# EAGLE design GeneratedKeyboard (EAGLE 9.3.1)
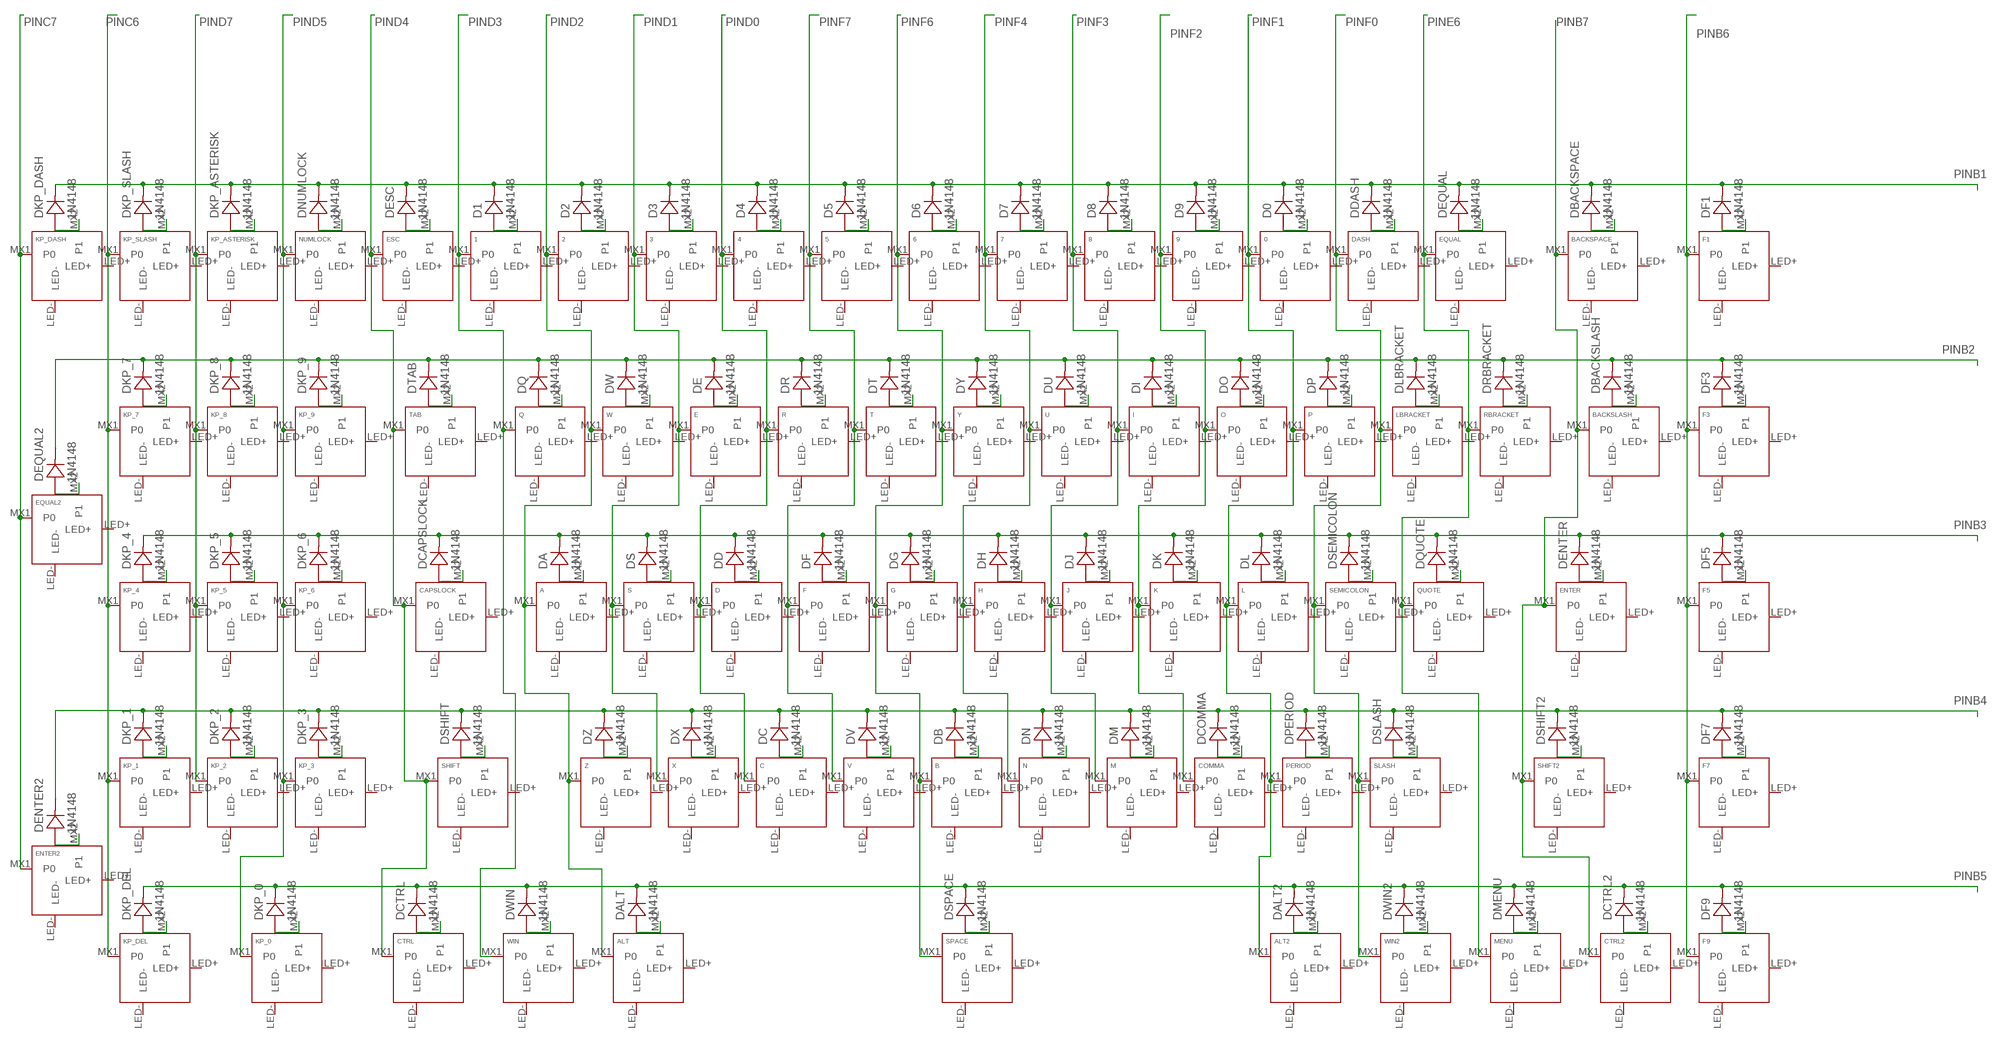
[diagram p0: schematic, sheet 1, part 1 of 2]
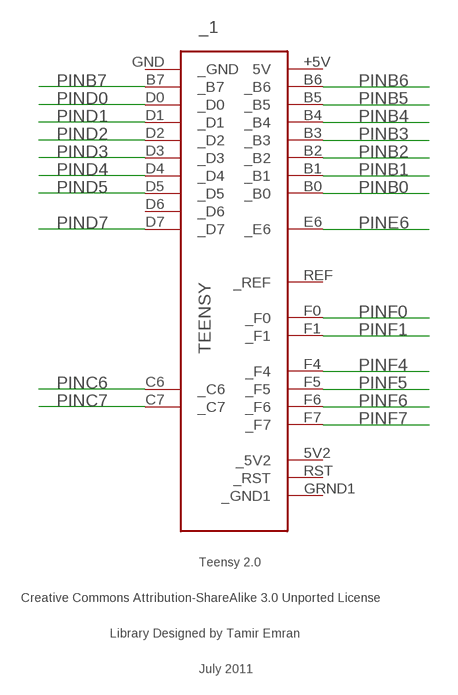
[diagram p1: schematic, sheet 1, part 2 of 2]

## Parts
0  KEYSWITCH-LED-MX-1U-LED  [MX-1U-LED]
1  KEYSWITCH-LED-MX-1U-LED  [MX-1U-LED]
2  KEYSWITCH-LED-MX-1U-LED  [MX-1U-LED]
3  KEYSWITCH-LED-MX-1U-LED  [MX-1U-LED]
4  KEYSWITCH-LED-MX-1U-LED  [MX-1U-LED]
5  KEYSWITCH-LED-MX-1U-LED  [MX-1U-LED]
6  KEYSWITCH-LED-MX-1U-LED  [MX-1U-LED]
7  KEYSWITCH-LED-MX-1U-LED  [MX-1U-LED]
8  KEYSWITCH-LED-MX-1U-LED  [MX-1U-LED]
9  KEYSWITCH-LED-MX-1U-LED  [MX-1U-LED]
_1  TEENSY  [TEENSY]
A  KEYSWITCH-LED-MX-1U-LED  [MX-1U-LED]
ALT  KEYSWITCH-LED-MX-1U-LED  [MX-1U-LED]
ALT2  KEYSWITCH-LED-MX-1U-LED  [MX-1U-LED]
B  KEYSWITCH-LED-MX-1U-LED  [MX-1U-LED]
BACKSLASH  KEYSWITCH-LED-MX-1U-LED  [MX-1U-LED]
BACKSPACE  KEYSWITCH-LED-MX-2U-LED  [MX-2U-LED]
C  KEYSWITCH-LED-MX-1U-LED  [MX-1U-LED]
CAPSLOCK  KEYSWITCH-LED-MX-1U-LED  [MX-1U-LED]
COMMA  KEYSWITCH-LED-MX-1U-LED  [MX-1U-LED]
CTRL  KEYSWITCH-LED-MX-1U-LED  [MX-1U-LED]
CTRL2  KEYSWITCH-LED-MX-1U-LED  [MX-1U-LED]
D  KEYSWITCH-LED-MX-1U-LED  [MX-1U-LED]
D0  1N4148  DIODE-DO-35  [DO-35]
D1  1N4148  DIODE-DO-35  [DO-35]
D2  1N4148  DIODE-DO-35  [DO-35]
D3  1N4148  DIODE-DO-35  [DO-35]
D4  1N4148  DIODE-DO-35  [DO-35]
D5  1N4148  DIODE-DO-35  [DO-35]
D6  1N4148  DIODE-DO-35  [DO-35]
D7  1N4148  DIODE-DO-35  [DO-35]
D8  1N4148  DIODE-DO-35  [DO-35]
D9  1N4148  DIODE-DO-35  [DO-35]
DA  1N4148  DIODE-DO-35  [DO-35]
DALT  1N4148  DIODE-DO-35  [DO-35]
DALT2  1N4148  DIODE-DO-35  [DO-35]
DASH  KEYSWITCH-LED-MX-1U-LED  [MX-1U-LED]
DB  1N4148  DIODE-DO-35  [DO-35]
DBACKSLASH  1N4148  DIODE-DO-35  [DO-35]
DBACKSPACE  1N4148  DIODE-DO-35  [DO-35]
DC  1N4148  DIODE-DO-35  [DO-35]
DCAPSLOCK  1N4148  DIODE-DO-35  [DO-35]
DCOMMA  1N4148  DIODE-DO-35  [DO-35]
DCTRL  1N4148  DIODE-DO-35  [DO-35]
DCTRL2  1N4148  DIODE-DO-35  [DO-35]
DD  1N4148  DIODE-DO-35  [DO-35]
DDASH  1N4148  DIODE-DO-35  [DO-35]
DE  1N4148  DIODE-DO-35  [DO-35]
DENTER  1N4148  DIODE-DO-35  [DO-35]
DENTER2  1N4148  DIODE-DO-35  [DO-35]
DEQUAL  1N4148  DIODE-DO-35  [DO-35]
DEQUAL2  1N4148  DIODE-DO-35  [DO-35]
DESC  1N4148  DIODE-DO-35  [DO-35]
DF  1N4148  DIODE-DO-35  [DO-35]
DF1  1N4148  DIODE-DO-35  [DO-35]
DF3  1N4148  DIODE-DO-35  [DO-35]
DF5  1N4148  DIODE-DO-35  [DO-35]
DF7  1N4148  DIODE-DO-35  [DO-35]
DF9  1N4148  DIODE-DO-35  [DO-35]
DG  1N4148  DIODE-DO-35  [DO-35]
DH  1N4148  DIODE-DO-35  [DO-35]
DI  1N4148  DIODE-DO-35  [DO-35]
DJ  1N4148  DIODE-DO-35  [DO-35]
DK  1N4148  DIODE-DO-35  [DO-35]
DKP_0  1N4148  DIODE-DO-35  [DO-35]
DKP_1  1N4148  DIODE-DO-35  [DO-35]
DKP_2  1N4148  DIODE-DO-35  [DO-35]
DKP_3  1N4148  DIODE-DO-35  [DO-35]
DKP_4  1N4148  DIODE-DO-35  [DO-35]
DKP_5  1N4148  DIODE-DO-35  [DO-35]
DKP_6  1N4148  DIODE-DO-35  [DO-35]
DKP_7  1N4148  DIODE-DO-35  [DO-35]
DKP_8  1N4148  DIODE-DO-35  [DO-35]
DKP_9  1N4148  DIODE-DO-35  [DO-35]
DKP_ASTERISK  1N4148  DIODE-DO-35  [DO-35]
DKP_DASH  1N4148  DIODE-DO-35  [DO-35]
DKP_DEL  1N4148  DIODE-DO-35  [DO-35]
DKP_SLASH  1N4148  DIODE-DO-35  [DO-35]
DL  1N4148  DIODE-DO-35  [DO-35]
DLBRACKET  1N4148  DIODE-DO-35  [DO-35]
DM  1N4148  DIODE-DO-35  [DO-35]
DMENU  1N4148  DIODE-DO-35  [DO-35]
DN  1N4148  DIODE-DO-35  [DO-35]
DNUMLOCK  1N4148  DIODE-DO-35  [DO-35]
DO  1N4148  DIODE-DO-35  [DO-35]
DP  1N4148  DIODE-DO-35  [DO-35]
DPERIOD  1N4148  DIODE-DO-35  [DO-35]
DQ  1N4148  DIODE-DO-35  [DO-35]
DQUOTE  1N4148  DIODE-DO-35  [DO-35]
DR  1N4148  DIODE-DO-35  [DO-35]
DRBRACKET  1N4148  DIODE-DO-35  [DO-35]
DS  1N4148  DIODE-DO-35  [DO-35]
DSEMICOLON  1N4148  DIODE-DO-35  [DO-35]
DSHIFT  1N4148  DIODE-DO-35  [DO-35]
DSHIFT2  1N4148  DIODE-DO-35  [DO-35]
DSLASH  1N4148  DIODE-DO-35  [DO-35]
DSPACE  1N4148  DIODE-DO-35  [DO-35]
DT  1N4148  DIODE-DO-35  [DO-35]
DTAB  1N4148  DIODE-DO-35  [DO-35]
DU  1N4148  DIODE-DO-35  [DO-35]
DV  1N4148  DIODE-DO-35  [DO-35]
DW  1N4148  DIODE-DO-35  [DO-35]
DWIN  1N4148  DIODE-DO-35  [DO-35]
DWIN2  1N4148  DIODE-DO-35  [DO-35]
DX  1N4148  DIODE-DO-35  [DO-35]
DY  1N4148  DIODE-DO-35  [DO-35]
DZ  1N4148  DIODE-DO-35  [DO-35]
E  KEYSWITCH-LED-MX-1U-LED  [MX-1U-LED]
ENTER  KEYSWITCH-LED-MX-2U-LED  [MX-2U-LED]
ENTER2  KEYSWITCH-LED-MX-1U-LED  [MX-1U-LED]
EQUAL  KEYSWITCH-LED-MX-1U-LED  [MX-1U-LED]
EQUAL2  KEYSWITCH-LED-MX-1U-LED  [MX-1U-LED]
ESC  KEYSWITCH-LED-MX-1U-LED  [MX-1U-LED]
F  KEYSWITCH-LED-MX-1U-LED  [MX-1U-LED]
F1  KEYSWITCH-LED-MX-1U-LED  [MX-1U-LED]
F3  KEYSWITCH-LED-MX-1U-LED  [MX-1U-LED]
F5  KEYSWITCH-LED-MX-1U-LED  [MX-1U-LED]
F7  KEYSWITCH-LED-MX-1U-LED  [MX-1U-LED]
F9  KEYSWITCH-LED-MX-1U-LED  [MX-1U-LED]
G  KEYSWITCH-LED-MX-1U-LED  [MX-1U-LED]
H  KEYSWITCH-LED-MX-1U-LED  [MX-1U-LED]
I  KEYSWITCH-LED-MX-1U-LED  [MX-1U-LED]
J  KEYSWITCH-LED-MX-1U-LED  [MX-1U-LED]
K  KEYSWITCH-LED-MX-1U-LED  [MX-1U-LED]
KP_0  KEYSWITCH-LED-MX-2U-LED  [MX-2U-LED]
KP_1  KEYSWITCH-LED-MX-1U-LED  [MX-1U-LED]
KP_2  KEYSWITCH-LED-MX-1U-LED  [MX-1U-LED]
KP_3  KEYSWITCH-LED-MX-1U-LED  [MX-1U-LED]
KP_4  KEYSWITCH-LED-MX-1U-LED  [MX-1U-LED]
KP_5  KEYSWITCH-LED-MX-1U-LED  [MX-1U-LED]
KP_6  KEYSWITCH-LED-MX-1U-LED  [MX-1U-LED]
KP_7  KEYSWITCH-LED-MX-1U-LED  [MX-1U-LED]
KP_8  KEYSWITCH-LED-MX-1U-LED  [MX-1U-LED]
KP_9  KEYSWITCH-LED-MX-1U-LED  [MX-1U-LED]
KP_ASTERISK  KEYSWITCH-LED-MX-1U-LED  [MX-1U-LED]
KP_DASH  KEYSWITCH-LED-MX-1U-LED  [MX-1U-LED]
KP_DEL  KEYSWITCH-LED-MX-1U-LED  [MX-1U-LED]
KP_SLASH  KEYSWITCH-LED-MX-1U-LED  [MX-1U-LED]
L  KEYSWITCH-LED-MX-1U-LED  [MX-1U-LED]
LBRACKET  KEYSWITCH-LED-MX-1U-LED  [MX-1U-LED]
M  KEYSWITCH-LED-MX-1U-LED  [MX-1U-LED]
MENU  KEYSWITCH-LED-MX-1U-LED  [MX-1U-LED]
N  KEYSWITCH-LED-MX-1U-LED  [MX-1U-LED]
NUMLOCK  KEYSWITCH-LED-MX-1U-LED  [MX-1U-LED]
O  KEYSWITCH-LED-MX-1U-LED  [MX-1U-LED]
P  KEYSWITCH-LED-MX-1U-LED  [MX-1U-LED]
PERIOD  KEYSWITCH-LED-MX-1U-LED  [MX-1U-LED]
Q  KEYSWITCH-LED-MX-1U-LED  [MX-1U-LED]
QUOTE  KEYSWITCH-LED-MX-1U-LED  [MX-1U-LED]
R  KEYSWITCH-LED-MX-1U-LED  [MX-1U-LED]
RBRACKET  KEYSWITCH-LED-MX-1U-LED  [MX-1U-LED]
S  KEYSWITCH-LED-MX-1U-LED  [MX-1U-LED]
SEMICOLON  KEYSWITCH-LED-MX-1U-LED  [MX-1U-LED]
SHIFT  KEYSWITCH-LED-MX-2U-LED  [MX-2U-LED]
SHIFT2  KEYSWITCH-LED-MX-2U-LED  [MX-2U-LED]
SLASH  KEYSWITCH-LED-MX-1U-LED  [MX-1U-LED]
SPACE  KEYSWITCH-LED-MX-6.25U-LED  [MX-6.25U-LED]
T  KEYSWITCH-LED-MX-1U-LED  [MX-1U-LED]
TAB  KEYSWITCH-LED-MX-1U-LED  [MX-1U-LED]
U  KEYSWITCH-LED-MX-1U-LED  [MX-1U-LED]
V  KEYSWITCH-LED-MX-1U-LED  [MX-1U-LED]
W  KEYSWITCH-LED-MX-1U-LED  [MX-1U-LED]
WIN  KEYSWITCH-LED-MX-1U-LED  [MX-1U-LED]
WIN2  KEYSWITCH-LED-MX-1U-LED  [MX-1U-LED]
X  KEYSWITCH-LED-MX-1U-LED  [MX-1U-LED]
Y  KEYSWITCH-LED-MX-1U-LED  [MX-1U-LED]
Z  KEYSWITCH-LED-MX-1U-LED  [MX-1U-LED]

## Nets
N$1: DKP_DASH.A KP_DASH.MX2(P1)
N$2: DKP_SLASH.A KP_SLASH.MX2(P1)
N$3: DKP_ASTERISK.A KP_ASTERISK.MX2(P1)
N$4: DNUMLOCK.A NUMLOCK.MX2(P1)
N$5: DESC.A ESC.MX2(P1)
N$6: 2.MX2(P1) D2.A
N$7: 3.MX2(P1) D3.A
N$8: 1.MX2(P1) D1.A
N$9: 4.MX2(P1) D4.A
N$10: 5.MX2(P1) D5.A
N$11: 6.MX2(P1) D6.A
N$12: 7.MX2(P1) D7.A
N$13: 8.MX2(P1) D8.A
N$14: 9.MX2(P1) D9.A
N$15: 0.MX2(P1) D0.A
N$16: DASH.MX2(P1) DDASH.A
N$17: DEQUAL.A EQUAL.MX2(P1)
N$18: BACKSPACE.MX2(P1) DBACKSPACE.A
N$19: DF1.A F1.MX2(P1)
N$20: DF3.A F3.MX2(P1)
N$21: BACKSLASH.MX2(P1) DBACKSLASH.A
N$22: DRBRACKET.A RBRACKET.MX2(P1)
N$23: DLBRACKET.A LBRACKET.MX2(P1)
N$24: DP.A P.MX2(P1)
N$25: DO.A O.MX2(P1)
N$26: DI.A I.MX2(P1)
N$27: DU.A U.MX2(P1)
N$28: DY.A Y.MX2(P1)
N$29: DT.A T.MX2(P1)
N$30: DR.A R.MX2(P1)
N$31: DE.A E.MX2(P1)
N$32: DW.A W.MX2(P1)
N$33: DQ.A Q.MX2(P1)
N$34: DTAB.A TAB.MX2(P1)
N$35: DKP_9.A KP_9.MX2(P1)
N$36: DKP_8.A KP_8.MX2(P1)
N$37: DKP_7.A KP_7.MX2(P1)
N$38: DEQUAL2.A EQUAL2.MX2(P1)
N$39: DKP_4.A KP_4.MX2(P1)
N$40: DKP_5.A KP_5.MX2(P1)
N$41: DKP_6.A KP_6.MX2(P1)
N$42: CAPSLOCK.MX2(P1) DCAPSLOCK.A
N$43: A.MX2(P1) DA.A
N$44: DS.A S.MX2(P1)
N$45: D.MX2(P1) DD.A
N$46: DF.A F.MX2(P1)
N$47: DG.A G.MX2(P1)
N$48: DH.A H.MX2(P1)
N$49: DJ.A J.MX2(P1)
N$50: DK.A K.MX2(P1)
N$51: DL.A L.MX2(P1)
N$52: DSEMICOLON.A SEMICOLON.MX2(P1)
N$53: DQUOTE.A QUOTE.MX2(P1)
N$54: DENTER.A ENTER.MX2(P1)
N$55: DF5.A F5.MX2(P1)
N$56: DF7.A F7.MX2(P1)
N$57: DSHIFT2.A SHIFT2.MX2(P1)
N$58: DSLASH.A SLASH.MX2(P1)
N$59: DPERIOD.A PERIOD.MX2(P1)
N$60: COMMA.MX2(P1) DCOMMA.A
N$61: DM.A M.MX2(P1)
N$62: DN.A N.MX2(P1)
N$63: B.MX2(P1) DB.A
N$64: DV.A V.MX2(P1)
N$65: C.MX2(P1) DC.A
N$66: DX.A X.MX2(P1)
N$67: DZ.A Z.MX2(P1)
N$68: DSHIFT.A SHIFT.MX2(P1)
N$69: DKP_3.A KP_3.MX2(P1)
N$70: DKP_2.A KP_2.MX2(P1)
N$71: DKP_1.A KP_1.MX2(P1)
N$72: DENTER2.A ENTER2.MX2(P1)
N$73: DKP_DEL.A KP_DEL.MX2(P1)
N$74: DKP_0.A KP_0.MX2(P1)
N$75: CTRL.MX2(P1) DCTRL.A
N$76: DWIN.A WIN.MX2(P1)
N$77: ALT.MX2(P1) DALT.A
N$78: DSPACE.A SPACE.MX2(P1)
N$79: ALT2.MX2(P1) DALT2.A
N$80: DWIN2.A WIN2.MX2(P1)
N$81: DMENU.A MENU.MX2(P1)
N$82: CTRL2.MX2(P1) DCTRL2.A
N$83: DF9.A F9.MX2(P1)
PINB0: _1.B0(_B0)
PINB1: _1.B1(_B1) D0.C D1.C D2.C D3.C D4.C D5.C D6.C D7.C D8.C D9.C DBACKSPACE.C DDASH.C DEQUAL.C DESC.C DF1.C DKP_ASTERISK.C DKP_DASH.C DKP_SLASH.C DNUMLOCK.C
PINB2: _1.B2(_B2) DBACKSLASH.C DE.C DEQUAL2.C DF3.C DI.C DKP_7.C DKP_8.C DKP_9.C DLBRACKET.C DO.C DP.C DQ.C DR.C DRBRACKET.C DT.C DTAB.C DU.C DW.C DY.C
PINB3: _1.B3(_B3) DA.C DCAPSLOCK.C DD.C DENTER.C DF5.C DF.C DG.C DH.C DJ.C DK.C DKP_4.C DKP_5.C DKP_6.C DL.C DQUOTE.C DS.C DSEMICOLON.C
PINB4: _1.B4(_B4) DB.C DC.C DCOMMA.C DENTER2.C DF7.C DKP_1.C DKP_2.C DKP_3.C DM.C DN.C DPERIOD.C DSHIFT2.C DSHIFT.C DSLASH.C DV.C DX.C DZ.C
PINB5: _1.B5(_B5) DALT2.C DALT.C DCTRL2.C DCTRL.C DF9.C DKP_0.C DKP_DEL.C DMENU.C DSPACE.C DWIN2.C DWIN.C
PINB6: _1.B6(_B6) F1.MX1(P0) F3.MX1(P0) F5.MX1(P0) F7.MX1(P0) F9.MX1(P0)
PINB7: _1.B7(_B7) BACKSLASH.MX1(P0) BACKSPACE.MX1(P0) CTRL2.MX1(P0) ENTER.MX1(P0) SHIFT2.MX1(P0)
PINC6: _1.C6(_C6) KP_1.MX1(P0) KP_4.MX1(P0) KP_7.MX1(P0) KP_DEL.MX1(P0) KP_SLASH.MX1(P0)
PINC7: _1.C7(_C7) ENTER2.MX1(P0) EQUAL2.MX1(P0) KP_DASH.MX1(P0)
PIND0: 4.MX1(P0) _1.D0(_D0) C.MX1(P0) D.MX1(P0) R.MX1(P0)
PIND1: 3.MX1(P0) _1.D1(_D1) E.MX1(P0) S.MX1(P0) X.MX1(P0)
PIND2: 2.MX1(P0) _1.D2(_D2) A.MX1(P0) ALT.MX1(P0) W.MX1(P0) Z.MX1(P0)
PIND3: 1.MX1(P0) _1.D3(_D3) Q.MX1(P0) WIN.MX1(P0)
PIND4: _1.D4(_D4) CAPSLOCK.MX1(P0) CTRL.MX1(P0) ESC.MX1(P0) SHIFT.MX1(P0) TAB.MX1(P0)
PIND5: _1.D5(_D5) KP_0.MX1(P0) KP_3.MX1(P0) KP_6.MX1(P0) KP_9.MX1(P0) NUMLOCK.MX1(P0)
PIND7: _1.D7(_D7) KP_2.MX1(P0) KP_5.MX1(P0) KP_8.MX1(P0) KP_ASTERISK.MX1(P0)
PINE6: _1.E6(_E6) EQUAL.MX1(P0) MENU.MX1(P0) QUOTE.MX1(P0) RBRACKET.MX1(P0)
PINF0: _1.F0(_F0) DASH.MX1(P0) LBRACKET.MX1(P0) SEMICOLON.MX1(P0) SLASH.MX1(P0) WIN2.MX1(P0)
PINF1: 0.MX1(P0) _1.F1(_F1) ALT2.MX1(P0) L.MX1(P0) P.MX1(P0) PERIOD.MX1(P0)
PINF2: 9.MX1(P0) COMMA.MX1(P0) K.MX1(P0) O.MX1(P0)
PINF3: 8.MX1(P0) I.MX1(P0) J.MX1(P0) M.MX1(P0)
PINF4: 7.MX1(P0) _1.F4(_F4) H.MX1(P0) N.MX1(P0) U.MX1(P0)
PINF5: _1.F5(_F5)
PINF6: 6.MX1(P0) _1.F6(_F6) B.MX1(P0) G.MX1(P0) SPACE.MX1(P0) Y.MX1(P0)
PINF7: 5.MX1(P0) _1.F7(_F7) F.MX1(P0) T.MX1(P0) V.MX1(P0)
Unconnected: 0.LED+ 0.LED- 1.LED+ 1.LED- 2.LED+ 2.LED- 3.LED+ 3.LED- 4.LED+ 4.LED- 5.LED+ 5.LED- 6.LED+ 6.LED- 7.LED+ 7.LED- 8.LED+ 8.LED- 9.LED+ 9.LED- _1.5V2(_5V2) _1.+5V(5V) _1.D6(_D6) _1.GND(_GND) _1.GRND1(_GND1) _1.REF(_REF) _1.RST(_RST) A.LED+ A.LED- ALT2.LED+ ALT2.LED- ALT.LED+ ALT.LED- B.LED+ B.LED- BACKSLASH.LED+ BACKSLASH.LED- BACKSPACE.LED+ BACKSPACE.LED- C.LED+ C.LED- CAPSLOCK.LED+ CAPSLOCK.LED- COMMA.LED+ COMMA.LED- CTRL2.LED+ CTRL2.LED- CTRL.LED+ CTRL.LED- D.LED+ D.LED- DASH.LED+ DASH.LED- E.LED+ E.LED- ENTER2.LED+ ENTER2.LED- ENTER.LED+ ENTER.LED- EQUAL2.LED+ EQUAL2.LED- EQUAL.LED+ EQUAL.LED- ESC.LED+ ESC.LED- F1.LED+ F1.LED- F3.LED+ F3.LED- F5.LED+ F5.LED- F7.LED+ F7.LED- F9.LED+ F9.LED- F.LED+ F.LED- G.LED+ G.LED- H.LED+ H.LED- I.LED+ I.LED- J.LED+ J.LED- K.LED+ K.LED- KP_0.LED+ KP_0.LED- KP_1.LED+ KP_1.LED- KP_2.LED+ KP_2.LED- KP_3.LED+ KP_3.LED- KP_4.LED+ KP_4.LED- KP_5.LED+ KP_5.LED- KP_6.LED+ KP_6.LED- KP_7.LED+ KP_7.LED- KP_8.LED+ KP_8.LED- KP_9.LED+ KP_9.LED- KP_ASTERISK.LED+ KP_ASTERISK.LED- KP_DASH.LED+ KP_DASH.LED- KP_DEL.LED+ KP_DEL.LED- KP_SLASH.LED+ KP_SLASH.LED- L.LED+ L.LED- LBRACKET.LED+ LBRACKET.LED- M.LED+ M.LED- MENU.LED+ MENU.LED- N.LED+ N.LED- NUMLOCK.LED+ NUMLOCK.LED- O.LED+ O.LED- P.LED+ P.LED- PERIOD.LED+ PERIOD.LED- Q.LED+ Q.LED- QUOTE.LED+ QUOTE.LED- R.LED+ R.LED- RBRACKET.LED+ RBRACKET.LED- S.LED+ S.LED- SEMICOLON.LED+ SEMICOLON.LED- SHIFT2.LED+ SHIFT2.LED- SHIFT.LED+ SHIFT.LED- SLASH.LED+ SLASH.LED- SPACE.LED+ SPACE.LED- T.LED+ T.LED- TAB.LED+ TAB.LED- U.LED+ U.LED- V.LED+ V.LED- W.LED+ W.LED- WIN2.LED+ WIN2.LED- WIN.LED+ WIN.LED- X.LED+ X.LED- Y.LED+ Y.LED- Z.LED+ Z.LED-

## Library data of the parts
0 1-9 A ALT ALT2 B BACKSLASH BACKSPACE C CAPSLOCK COMMA CTRL CTRL2 D DASH E ENTER ENTER2 EQUAL EQUAL2 ESC F F1 F3 F5 F7 F9 G H I J K KP_0 KP_1-KP_9 KP_ASTERISK KP_DASH KP_DEL KP_SLASH L LBRACKET M MENU N NUMLOCK O P PERIOD Q QUOTE R RBRACKET S SEMICOLON SHIFT SHIFT2 SLASH SPACE T TAB U V W WIN WIN2 X Y Z = Keyboard:KEYSWITCH-LED
_1 = teensy:TEENSY: Teensy 2.0 Original Design by Clint Fisher Modified Design by Tamir Emran Licensed Under Creative Commons Attribution-ShareAlike 3.0 Unported (CC BY-SA 3.0)
D0 D1-D9 DA DALT DALT2 DB DBACKSLASH DBACKSPACE DC DCAPSLOCK DCOMMA DCTRL DCTRL2 DD DDASH DE DENTER DENTER2 DEQUAL DEQUAL2 DESC DF DF1 DF3 DF5 DF7 DF9 DG DH DI DJ DK DKP_0 DKP_1-DKP_9 DKP_ASTERISK DKP_DASH DKP_DEL DKP_SLASH DL DLBRACKET DM DMENU DN DNUMLOCK DO DP DPERIOD DQ DQUOTE DR DRBRACKET DS DSEMICOLON DSHIFT DSHIFT2 DSLASH DSPACE DT DTAB DU DV DW DWIN DWIN2 DX DY DZ = Components:DIODE: Standard 1N4148 diode

## Board
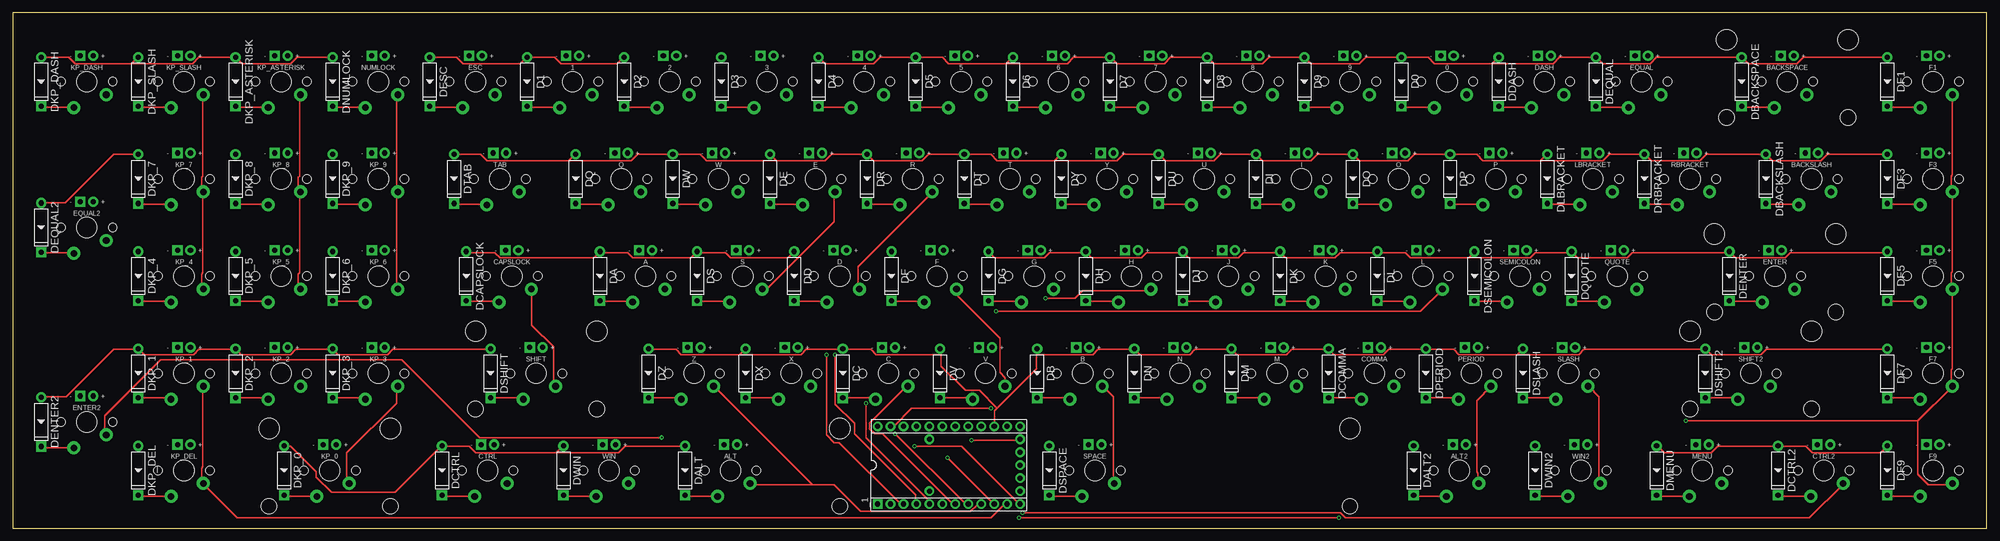
[diagram p2: board, top side]
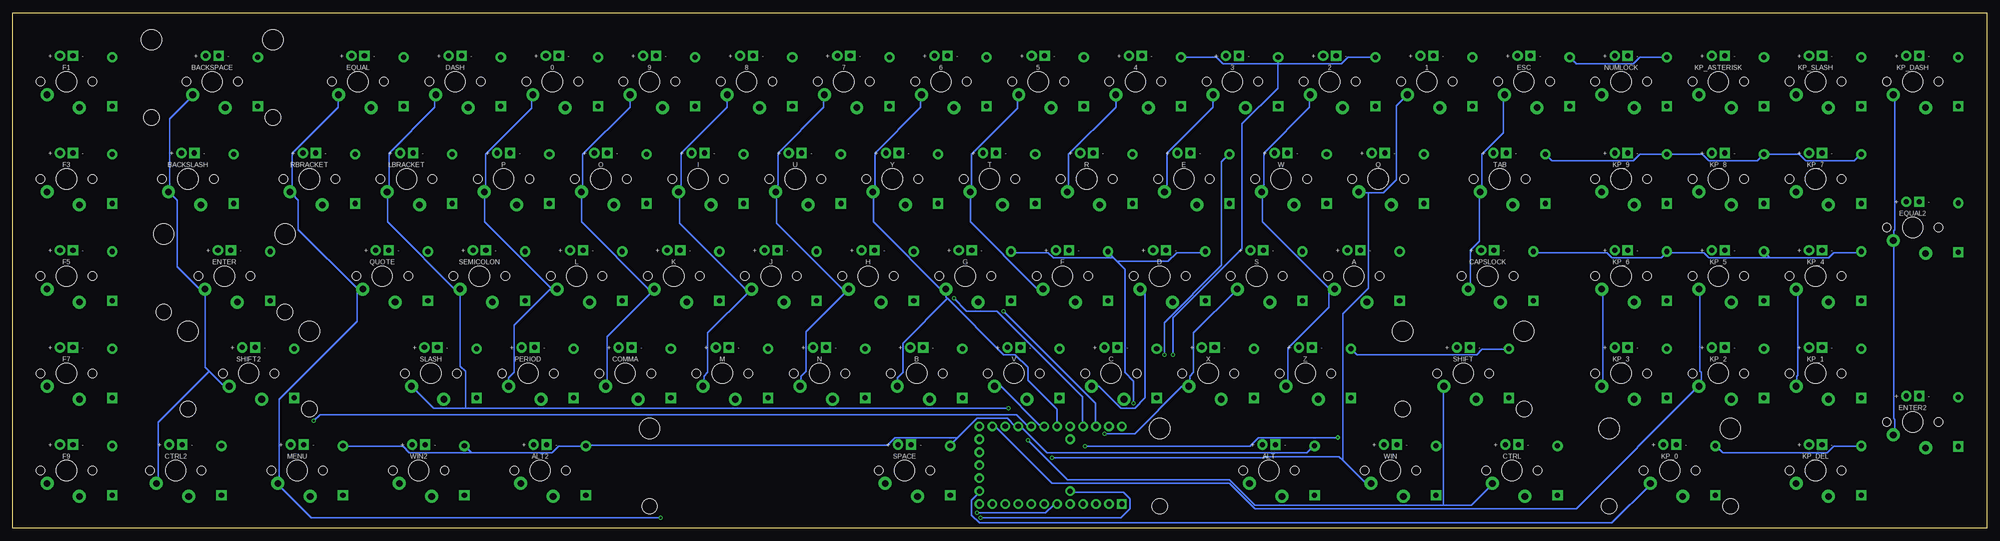
[diagram p3: board, bottom side, seen from below]

Size 387 x 101 mm. Coordinates in mm from the lower left corner, seen from the top.
Outline: 0,0 387,0 387,101 0,101 0,0
Copper layers (1*16): Top 0.035mm / dielectric 1.5mm / Bottom 0.035mm
Design rules "Standard": minimum track width 10mil, minimum drill 15mil, track to track 10mil, track to pad 10mil, pad to pad 10mil, via to via 10mil, smd to smd 10mil, copper to edge 20mil, drill to drill 10mil, minimum pad ring 8mil, minimum via ring 8mil, stop-mask expansion 4mil, vias tented up to drill 0mil, thermal gap 10mil

### Footprints (pad centres in the part's own frame; a part is rotated, then mirrored left to right if it is on the bottom)
MX-1U-LED = drill 1 pad 2: LED+ -1.27,-5.08 | drill 1 pad 2 square: LED- 1.27,-5.08 | drill 1.3 pad 2.54: MX1 -3.81,2.54; MX2 2.54,5.08 | hole 4: 0,0 | hole 1.7: -5.08,0; 5.08,0
TEENSY = drill 1.016 pad 1.88: 5V2 13.97,-2.54; +5V -13.97,7.62; B0 -11.43,-7.62; B1 -8.89,-7.62; B2 -6.35,-7.62; B3 -3.81,-7.62; B4 8.89,7.62; B5 6.35,7.62; B6 3.81,7.62; B7 -1.27,-7.62; C6 11.43,-7.62; C7 13.97,-7.62; D0 1.27,-7.62; D1 3.81,-7.62; D2 6.35,-7.62; D3 8.89,-7.62; D4 13.97,5.08; D5 13.97,-5.08; D6 13.97,7.62; D7 11.43,7.62; E6 -3.81,-5.08; F0 -11.43,7.62; F1 -8.89,7.62; F4 -6.35,7.62; F5 -3.81,7.62; F6 -1.27,7.62; F7 1.27,7.62; GRND1 13.97,0; REF -3.81,5.08; RST 13.97,2.54 | drill 1.016 pad 1.88 square: GND -13.97,-7.62
MX-2U-LED = drill 1 pad 2: LED+ -1.27,-5.08 | drill 1 pad 2 square: LED- 1.27,-5.08 | drill 1.3 pad 2.54: MX1 -3.81,2.54; MX2 2.54,5.08 | hole 4: 0,0; -11.9,-8.24; 11.9,-8.24 | hole 1.7: -5.08,0; 5.08,0 | hole 3.05: -11.9,7; 11.9,7
DO-35 = drill 1 pad 2 square: A 4.82,0 | drill 1 pad 2: C -4.82,0
MX-6.25U-LED = drill 1 pad 2: LED+ -1.27,-5.08 | drill 1 pad 2 square: LED- 1.27,-5.08 | drill 1.3 pad 2.54: MX1 -3.81,2.54; MX2 2.54,5.08 | hole 4: 0,0; -50,-8.24; 50,-8.24 | hole 1.7: -5.08,0; 5.08,0 | hole 3.05: -50,7; 50,7

### Placement (x,y rotation side)
0  281.22,87.48 180 top
1  109.77,87.48 180 top
2  128.82,87.48 180 top
3  147.87,87.48 180 top
4  166.92,87.48 180 top
5  185.97,87.48 180 top
6  205.02,87.48 180 top
7  224.07,87.48 180 top
8  243.12,87.48 180 top
9  262.17,87.48 180 top
_1  183.52,12.32 0 top
A  124.06,49.38 180 top
ALT  140.73,11.28 180 top
ALT2  283.6,11.28 180 top
B  209.78,30.33 180 top
BACKSLASH  352.66,68.43 180 top
BACKSPACE  347.9,87.48 180 top
C  171.68,30.33 180 top
CAPSLOCK  97.86,49.38 180 top
COMMA  266.93,30.33 180 top
CTRL  93.1,11.28 180 top
CTRL2  355.04,11.28 180 top
D  162.16,49.38 180 top
D0  272.27,87.48 270 top
D1  100.82,87.48 270 top
D2  119.87,87.48 270 top
D3  138.92,87.48 270 top
D4  157.97,87.48 270 top
D5  177.02,87.48 270 top
D6  196.07,87.48 270 top
D7  215.12,87.48 270 top
D8  234.17,87.48 270 top
D9  253.22,87.48 270 top
DA  115.11,49.38 270 top
DALT  131.78,11.28 270 top
DALT2  274.65,11.28 270 top
DASH  300.27,87.48 180 top
DB  200.83,30.33 270 top
DBACKSLASH  343.71,68.43 270 top
DBACKSPACE  338.95,87.48 270 top
DC  162.73,30.33 270 top
DCAPSLOCK  88.91,49.38 270 top
DCOMMA  257.98,30.33 270 top
DCTRL  84.15,11.28 270 top
DCTRL2  346.09,11.28 270 top
DD  153.21,49.38 270 top
DDASH  291.32,87.48 270 top
DE  148.45,68.43 270 top
DENTER  336.56,49.38 270 top
DENTER2  5.57,20.8 270 top
DEQUAL  310.37,87.48 270 top
DEQUAL2  5.57,58.9 270 top
DESC  81.77,87.48 270 top
DF  172.26,49.38 270 top
DF1  367.52,87.48 270 top
DF3  367.52,68.43 270 top
DF5  367.52,49.38 270 top
DF7  367.52,30.33 270 top
DF9  367.52,11.28 270 top
DG  191.31,49.38 270 top
DH  210.36,49.38 270 top
DI  243.7,68.43 270 top
DJ  229.41,49.38 270 top
DK  248.46,49.38 270 top
DKP_0  53.2,11.28 270 top
DKP_1  24.62,30.33 270 top
DKP_2  43.67,30.33 270 top
DKP_3  62.72,30.33 270 top
DKP_4  24.62,49.38 270 top
DKP_5  43.67,49.38 270 top
DKP_6  62.72,49.38 270 top
DKP_7  24.62,68.43 270 top
DKP_8  43.67,68.43 270 top
DKP_9  62.72,68.43 270 top
DKP_ASTERISK  43.67,87.48 270 top
DKP_DASH  5.57,87.48 270 top
DKP_DEL  24.62,11.28 270 top
DKP_SLASH  24.62,87.48 270 top
DL  267.51,49.38 270 top
DLBRACKET  300.85,68.43 270 top
DM  238.93,30.33 270 top
DMENU  322.28,11.28 270 top
DN  219.88,30.33 270 top
DNUMLOCK  62.72,87.48 270 top
DO  262.75,68.43 270 top
DP  281.8,68.43 270 top
DPERIOD  277.03,30.33 270 top
DQ  110.35,68.43 270 top
DQUOTE  305.61,49.38 270 top
DR  167.5,68.43 270 top
DRBRACKET  319.9,68.43 270 top
DS  134.16,49.38 270 top
DSEMICOLON  286.56,49.38 270 top
DSHIFT  93.68,30.33 270 top
DSHIFT2  331.8,30.33 270 top
DSLASH  296.08,30.33 270 top
DSPACE  203.21,11.28 270 top
DT  186.55,68.43 270 top
DTAB  86.53,68.43 270 top
DU  224.65,68.43 270 top
DV  181.78,30.33 270 top
DW  129.4,68.43 270 top
DWIN  107.96,11.28 270 top
DWIN2  298.46,11.28 270 top
DX  143.68,30.33 270 top
DY  205.6,68.43 270 top
DZ  124.63,30.33 270 top
E  157.4,68.43 180 top
ENTER  345.51,49.38 180 top
ENTER2  14.52,20.8 180 top
EQUAL  319.32,87.48 180 top
EQUAL2  14.52,58.9 180 top
ESC  90.72,87.48 180 top
F  181.21,49.38 180 top
F1  376.47,87.48 180 top
F3  376.47,68.43 180 top
F5  376.47,49.38 180 top
F7  376.47,30.33 180 top
F9  376.47,11.28 180 top
G  200.26,49.38 180 top
H  219.31,49.38 180 top
I  252.65,68.43 180 top
J  238.36,49.38 180 top
K  257.41,49.38 180 top
KP_0  62.15,11.28 180 top
KP_1  33.57,30.33 180 top
KP_2  52.62,30.33 180 top
KP_3  71.67,30.33 180 top
KP_4  33.57,49.38 180 top
KP_5  52.62,49.38 180 top
KP_6  71.67,49.38 180 top
KP_7  33.57,68.43 180 top
KP_8  52.62,68.43 180 top
KP_9  71.67,68.43 180 top
KP_ASTERISK  52.62,87.48 180 top
KP_DASH  14.52,87.48 180 top
KP_DEL  33.57,11.28 180 top
KP_SLASH  33.57,87.48 180 top
L  276.46,49.38 180 top
LBRACKET  309.8,68.43 180 top
M  247.88,30.33 180 top
MENU  331.23,11.28 180 top
N  228.83,30.33 180 top
NUMLOCK  71.67,87.48 180 top
O  271.7,68.43 180 top
P  290.75,68.43 180 top
PERIOD  285.98,30.33 180 top
Q  119.3,68.43 180 top
QUOTE  314.56,49.38 180 top
R  176.45,68.43 180 top
RBRACKET  328.85,68.43 180 top
S  143.11,49.38 180 top
SEMICOLON  295.51,49.38 180 top
SHIFT  102.63,30.33 180 top
SHIFT2  340.75,30.33 180 top
SLASH  305.03,30.33 180 top
SPACE  212.16,11.28 180 top
T  195.5,68.43 180 top
TAB  95.48,68.43 180 top
U  233.6,68.43 180 top
V  190.73,30.33 180 top
W  138.35,68.43 180 top
WIN  116.91,11.28 180 top
WIN2  307.41,11.28 180 top
X  152.63,30.33 180 top
Y  214.55,68.43 180 top
Z  133.58,30.33 180 top

### Tracks (layer width: path | path; a pad name or v marks a point on that pad's centre or on a via)
N$1
  Top 0.254: DKP_DASH.A 5.75,82.5 11.75,82.5 KP_DASH.MX2
N$2
  Top 0.254: DKP_SLASH.A 24.75,82.5 31,82.5 KP_SLASH.MX2
N$3
  Top 0.254: DKP_ASTERISK.A 43.75,82.5 50,82.5 KP_ASTERISK.MX2
N$4
  Top 0.254: DNUMLOCK.A 62.75,82.5 69,82.5 NUMLOCK.MX2
N$5
  Top 0.254: DESC.A 82,82.5 88,82.5 ESC.MX2
N$6
  Top 0.254: D2.A 120,82.5 126.25,82.5 2.MX2
N$7
  Top 0.254: D3.A 139,82.5 145.25,82.5 3.MX2
N$8
  Top 0.254: D1.A 101,82.5 107,82.5 1.MX2
N$9
  Top 0.254: D4.A 158,82.5 164.25,82.5 4.MX2
N$10
  Top 0.254: D5.A 177.25,82.5 183.25,82.5 5.MX2
N$11
  Top 0.254: D6.A 196.25,82.5 202.25,82.5 6.MX2
N$12
  Top 0.254: D7.A 215.25,82.5 221.5,82.5 7.MX2
N$13
  Top 0.254: D8.A 234.25,82.5 240.5,82.5 8.MX2
N$14
  Top 0.254: D9.A 253.25,82.5 259.5,82.5 9.MX2
N$15
  Top 0.254: D0.A 272.5,82.5 278.5,82.5 0.MX2
N$16
  Top 0.254: DDASH.A 291.5,82.5 297.5,82.5 DASH.MX2
N$17
  Top 0.254: DEQUAL.A 310.5,82.5 316.75,82.5 EQUAL.MX2
N$18
  Top 0.254: DBACKSPACE.A 339,82.5 345.25,82.5 BACKSPACE.MX2
N$19
  Top 0.254: DF1.A 367.75,82.5 373.75,82.5 F1.MX2
N$20
  Top 0.254: DF3.A 367.75,63.5 373.75,63.5 F3.MX2
N$21
  Top 0.254: DBACKSLASH.A 343.75,63.5 350,63.5 BACKSLASH.MX2
N$22
  Top 0.254: DRBRACKET.A 320,63.5 326.25,63.5 RBRACKET.MX2
N$23
  Top 0.254: DLBRACKET.A 301,63.5 307.25,63.5 LBRACKET.MX2
N$24
  Top 0.254: DP.A 282,63.5 288,63.5 P.MX2
N$25
  Top 0.254: DO.A 262.75,63.5 269,63.5 O.MX2
N$26
  Top 0.254: DI.A 243.75,63.5 250,63.5 I.MX2
N$27
  Top 0.254: DU.A 224.75,63.5 231,63.5 U.MX2
N$28
  Top 0.254: DY.A 205.75,63.5 212,63.5 Y.MX2
N$29
  Top 0.254: DT.A 186.75,63.5 192.75,63.5 T.MX2
N$30
  Top 0.254: DR.A 167.5,63.5 173.75,63.5 R.MX2
N$31
  Top 0.254: DE.A 148.5,63.5 154.75,63.5 E.MX2
N$32
  Top 0.254: DW.A 129.5,63.5 135.75,63.5 W.MX2
N$33
  Top 0.254: DQ.A 110.5,63.5 116.75,63.5 Q.MX2
N$34
  Top 0.254: DTAB.A 86.75,63.5 92.75,63.5 TAB.MX2
N$35
  Top 0.254: DKP_9.A 62.75,63.5 69,63.5 KP_9.MX2
N$36
  Top 0.254: DKP_8.A 43.75,63.5 50,63.5 KP_8.MX2
N$37
  Top 0.254: DKP_7.A 24.75,63.5 31,63.5 KP_7.MX2
N$38
  Top 0.254: DEQUAL2.A 5.75,54 11.75,54 EQUAL2.MX2
N$39
  Top 0.254: DKP_4.A 24.75,44.5 31,44.5 KP_4.MX2
N$40
  Top 0.254: DKP_5.A 43.75,44.5 50,44.5 KP_5.MX2
N$41
  Top 0.254: DKP_6.A 62.75,44.5 69,44.5 KP_6.MX2
N$42
  Top 0.254: DCAPSLOCK.A 89,44.5 95.25,44.5 CAPSLOCK.MX2
N$43
  Top 0.254: DA.A 115.25,44.5 121.5,44.5 A.MX2
N$44
  Top 0.254: DS.A 134.25,44.5 140.5,44.5 S.MX2
N$45
  Top 0.254: DD.A 153.25,44.5 159.5,44.5 D.MX2
N$46
  Top 0.254: DF.A 172.5,44.5 178.5,44.5 F.MX2
N$47
  Top 0.254: DG.A 191.5,44.5 197.5,44.5 G.MX2
N$48
  Top 0.254: DH.A 210.5,44.5 216.75,44.5 H.MX2
N$49
  Top 0.254: DJ.A 229.5,44.5 235.75,44.5 J.MX2
N$50
  Top 0.254: DK.A 248.5,44.5 254.75,44.5 K.MX2
N$51
  Top 0.254: DL.A 267.75,44.5 273.75,44.5 L.MX2
N$52
  Top 0.254: DSEMICOLON.A 286.75,44.5 292.75,44.5 SEMICOLON.MX2
N$53
  Top 0.254: DQUOTE.A 305.75,44.5 312,44.5 QUOTE.MX2
N$54
  Top 0.254: DENTER.A 336.75,44.5 342.75,44.5 ENTER.MX2
N$55
  Top 0.254: DF5.A 367.75,44.5 373.75,44.5 F5.MX2
N$56
  Top 0.254: DF7.A 367.75,25.5 373.5,25.5 373.75,25.25 F7.MX2
N$57
  Top 0.254: DSHIFT2.A 332,25.5 337.75,25.5 338,25.25 SHIFT2.MX2
N$58
  Top 0.254: DSLASH.A 296.25,25.5 302,25.5 302.25,25.25 SLASH.MX2
N$59
  Top 0.254: DPERIOD.A 277.25,25.5 283,25.5 283.25,25.25 PERIOD.MX2
N$60
  Top 0.254: DCOMMA.A 258,25.5 264,25.5 264.25,25.25 COMMA.MX2
N$61
  Top 0.254: DM.A 239,25.5 245,25.5 245.25,25.25 M.MX2
N$62
  Top 0.254: DN.A 220,25.5 226,25.5 226.25,25.25 N.MX2
N$63
  Top 0.254: DB.A 201,25.5 206.75,25.5 207,25.25 B.MX2
N$64
  Top 0.254: DV.A 182,25.5 187.75,25.5 188,25.25 V.MX2
N$65
  Top 0.254: DC.A 162.75,25.5 168.75,25.5 169,25.25 C.MX2
N$66
  Top 0.254: DX.A 143.75,25.5 149.75,25.5 150,25.25 X.MX2
N$67
  Top 0.254: DZ.A 124.75,25.5 130.75,25.5 131,25.25 Z.MX2
N$68
  Top 0.254: DSHIFT.A 93.75,25.5 99.75,25.5 100,25.25 SHIFT.MX2
N$69
  Top 0.254: DKP_3.A 62.75,25.5 68.75,25.5 69,25.25 KP_3.MX2
N$70
  Top 0.254: DKP_2.A 43.75,25.5 49.75,25.5 50,25.25 KP_2.MX2
N$71
  Top 0.254: DKP_1.A 24.75,25.5 30.75,25.5 31,25.25 KP_1.MX2
N$72
  Top 0.254: DENTER2.A 5.75,15.75 11.75,15.75 ENTER2.MX2
N$73
  Top 0.254: DKP_DEL.A 24.75,6.25 31,6.25 KP_DEL.MX2
N$74
  Top 0.254: DKP_0.A 53.25,6.25 59.5,6.25 KP_0.MX2
N$75
  Top 0.254: DCTRL.A 84.25,6.25 90.5,6.25 CTRL.MX2
N$76
  Top 0.254: DWIN.A 108,6.25 114.25,6.25 WIN.MX2
N$77
  Top 0.254: DALT.A 132,6.25 138,6.25 ALT.MX2
N$78
  Top 0.254: DSPACE.A 203.25,6.25 209.5,6.25 SPACE.MX2
N$79
  Top 0.254: DALT2.A 274.75,6.25 281,6.25 ALT2.MX2
N$80
  Top 0.254: DWIN2.A 298.5,6.25 304.75,6.25 WIN2.MX2
N$81
  Top 0.254: DMENU.A 322.5,6.25 328.5,6.25 MENU.MX2
N$82
  Top 0.254: DCTRL2.A 346.25,6.25 352.5,6.25 CTRL2.MX2
N$83
  Top 0.254: DF9.A 367.75,6.25 373.75,6.25 F9.MX2
PINB1  (via drill 0.38)
  Top 0.254: 290,91 278.75,91 277.5,92.25 272.5,92.25 D0.C 272.25,92.25 265.25,92.25 264,91 254.5,91 253.25,92.25 D9.C 253,92.25 246.25,92.25 245,91 235.5,91 234.25,92.25 D8.C 234,92.25 227,92.25 225.75,91 216.5,91 215.25,92.25 D7.C 215,92.25 208,92.25 206.75,91 194.75,91 | 290,91 291.25,92.25 DDASH.C | 290,91 302,91 303.25,92.25 310.25,92.25 DEQUAL.C 310.5,92.25 311.75,91 321,91 322.25,92.25 338.75,92.25 DBACKSPACE.C 340.25,91 349.75,91 351,92.25 367.5,92.25 DF1.C | 194.75,91 183.5,91 182.25,92.25 177.25,92.25 D5.C 177,92.25 170,92.25 168.75,91 159.25,91 158,92.25 D4.C | 194.75,91 196,92.25 D6.C | 23.25,91 12.25,91 11,92.25 5.75,92.25 DKP_DASH.C | 23.25,91 24.5,92.25 DKP_SLASH.C | 23.25,91 35.25,91 36.5,92.25 43.5,92.25 DKP_ASTERISK.C 43.75,92.25 45,91 54.5,91 55.75,92.25 62.5,92.25 DNUMLOCK.C | DESC.C 82,92.25 87,92.25 88.25,91 99.5,91 100.75,92.25 D1.C 101,92.25 106.25,92.25 107.5,91 118.5,91 119.75,92.25 D2.C | v159.5,34 159.5,18.25 161,16.75 162,16.75 174,4.75 174.5,4.75 _1.B1
  Bottom 0.254: v159.5,34 159.5,41.25 146,54.75 146,79.25 139,86.25 139,91 | 139,91 139,92.25 D3.C | 139,91 126.5,91 125.25,92.25 120,92.25 D2.C | 139,91 149.75,91 151,92.25 157.75,92.25 D4.C | DNUMLOCK.C 62.75,92.25 68,92.25 69.25,91 80.5,91 81.75,92.25 DESC.C
PINB2  (via drill 0.38)
  Top 0.254: 299.5,72 288.25,72 287,73.25 DP.C 274.75,73.25 273.5,72 264,72 DO.C 255.75,73.25 254.5,72 245,72 243.75,73.25 DI.C 236.75,73.25 235.5,72 226,72 224.75,73.25 DU.C 217.75,73.25 216.5,72 204.25,72 | 299.5,72 300.75,73.25 DLBRACKET.C | 299.5,72 311.75,72 313,73.25 DRBRACKET.C 320,73.25 321.25,72 330.75,72 332,73.25 DBACKSLASH.C 343.75,73.25 345,72 354.5,72 355.75,73.25 DF3.C | 204.25,72 193,72 191.75,73.25 DT.C 179.5,73.25 178.25,72 168.75,72 DR.C 160.5,73.25 159.25,72 149.75,72 | 204.25,72 205.5,73.25 DY.C | DKP_7.C 19.75,73.25 10.25,63.75 5.75,63.75 DEQUAL2.C | DTAB.C 91.75,73.25 93,72 109,72 | 109,72 110.25,73.25 DQ.C | 109,72 121.25,72 122.5,73.25 DW.C 134.75,73.25 136,72 149.75,72 | v161.25,34 161.25,24.25 165,20.5 165,18.5 177,6.5 177,4.75 _1.B2 | 149.75,72 148.5,73.25 DE.C
  Bottom 0.254: DKP_7.C 24.75,73.25 26,72 35.5,72 36.75,73.25 DKP_8.C 43.75,73.25 45,72 54.5,72 55.75,73.25 DKP_9.C 68,73.25 69.25,72 85.25,72 86.5,73.25 DTAB.C | v161.25,34 161.25,40.25 150,51.5 150,71.75 148.5,73.25 DE.C
PINB3  (via drill 0.38)
  Top 0.254: 285.5,53 274,53 273,54 267.75,54 DL.C 267.5,54 260.25,54 259.25,53 249.5,53 248.5,54 DK.C 248.25,54 241.25,54 240.25,53 230.5,53 229.5,54 DJ.C 229.25,54 222.25,54 221.25,53 211.5,53 210.5,54 DH.C 210.25,54 203.25,54 202.25,53 192.5,53 191.5,54 DG.C | 285.5,53 286.5,54 DSEMICOLON.C | 285.5,53 297.5,53 298.5,54 305.5,54 DQUOTE.C 305.75,54 306.75,53 316.5,53 317.5,54 336.5,54 DENTER.C 336.75,54 337.75,53 347.5,53 348.5,54 367.5,54 DF5.C | v167.25,24.5 167.25,17.75 179.5,5.5 179.5,4.75 _1.B3 | DD.C 153,54 152,53 140.75,53 139.75,54 134.25,54 DS.C 134,54 133,53 121.5,53 120.5,54 115.25,54 DA.C 115,54 114,53 95.5,53 94.5,54 89,54 DCAPSLOCK.C
  Bottom 0.254: 42.5,53 31,53 30,54 24.75,54 DKP_4.C | 42.5,53 43.5,54 DKP_5.C | 42.5,53 54.5,53 55.5,54 62.5,54 DKP_6.C 62.75,54 63.75,53 73.5,53 74.5,54 88.75,54 DCAPSLOCK.C | v167.25,24.5 167.25,28.75 169,30.5 169,50.75 170.5,52.25 | 171.25,53 172.25,54 DF.C | 171.25,53 170.5,52.25 | 170.5,52.25 160.5,52.25 158.75,54 153.25,54 DD.C | 171.25,53 183,53 184,54 191.25,54 DG.C
PINB4
  Top 0.254: DENTER2.C 5.75,25.75 10.5,25.75 19.75,35 24.5,35 DKP_1.C 24.75,35 25.75,34 35.5,34 36.5,35 43.5,35 DKP_2.C 43.75,35 44.75,34 54.5,34 55.5,35 62.5,35 DKP_3.C 62.75,35 63.75,34 73.5,34 74.5,35 93.5,35 DSHIFT.C | 295,34 283.5,34 282.5,35 277.25,35 DPERIOD.C 277,35 269.75,35 268.75,34 259,34 258,35 DCOMMA.C 257.75,35 250.75,35 249.75,34 240,34 239,35 DM.C 238.75,35 231.75,35 230.75,34 221,34 220,35 DN.C 219.75,35 212.75,35 211.75,34 200.75,34 | 295,34 296,35 DSLASH.C | 295,34 307,34 308,35 331.75,35 DSHIFT2.C 332,35 333,34 342.75,34 343.75,35 367.5,35 DF7.C | 142.5,34 131,34 130,35 124.75,35 DZ.C | 142.5,34 143.5,35 DX.C | 142.5,34 154.5,34 155.5,35 162.5,35 DC.C 162.75,35 168.25,35 169.25,34 182,34 | 193,23.5 200.75,31.25 200.75,34 | 193,23.5 192.5,23 192.5,20 _1.B4 | 200.75,34 200.75,35 DB.C | 182,34 182,31.75 186.75,27 189.5,27 193,23.5 | 182,34 182,35 DV.C
  Bottom 0.254: DSHIFT.C 93.75,35 99,35 100,34 123.5,34 124.5,35 DZ.C
PINB5
  Top 0.254: DF9.C 367.5,16 366.25,14.75 352.75,14.75 351.5,16 346.25,16 DCTRL2.C 346,16 334.25,16 333,14.75 323.75,14.75 322.5,16 DMENU.C | 106.5,14.75 90.75,14.75 89.5,16 84.25,16 DCTRL.C 84,16 75,7 62.5,7 59.5,10 59.5,11 54.5,16 53.25,16 DKP_0.C | 106.5,14.75 107.75,16 DWIN.C | 106.5,14.75 118.75,14.75 120,16 131.75,16 DALT.C
  Bottom 0.254: 297,14.75 281.25,14.75 280,16 274.75,16 DALT2.C 274.5,16.25 215.5,16.25 214,17.75 201.75,17.75 | 297,14.75 298.25,16 DWIN2.C | 297,14.75 309.25,14.75 310.5,16 322.25,16 DMENU.C | DKP_DEL.C 24.75,16 30,16 31.25,14.75 51.75,14.75 53,16 DKP_0.C | 201.75,17.75 203.25,16.25 DSPACE.C | 201.75,17.75 198,21.5 192,21.5 190.5,20 190,20 _1.B5 189.75,19.75 189.25,19.75 184.25,14.75 133.25,14.75 132,16 DALT.C
PINB6  (via drill 0.38)
  Top 0.254: 373.5,21 v328,21 | 380,27.5 380.25,27.75 F7.MX1 380,27.5 | 380,27.5 373.5,21 | 373.5,21 373.5,10.5 375.5,8.5 380.25,8.5 F9.MX1 | 380,27.5 380,31 380.25,31.25 380.25,46.75 F5.MX1 380.25,47 380,47.25 380,50 380.25,50.25 380.25,65.75 F3.MX1 380.25,66 380,66.25 380,69 380.25,69.25 380.25,84.75 F1.MX1
  Bottom 0.254: v328,21 326.75,22.25 190.25,22.25 188,20 187.5,20 _1.B6
PINB7  (via drill 0.38)
  Top 0.254: v198,3 260.25,3 261.25,2 352.25,2 358.75,8.5 CTRL2.MX1
  Bottom 0.254: 348.5,30.75 349.25,31.5 349.25,46.75 ENTER.MX1 349.5,47 350.5,47 354.75,51.25 354.75,64.25 356.25,65.75 BACKSLASH.MX1 356.25,66 356.25,80.25 351.75,84.75 BACKSPACE.MX1 | 348.5,30.75 345.75,28 344.75,28 SHIFT2.MX1 | v198,3 184.5,3 183,4.5 182.25,4.5 _1.B7 | 348.5,30.75 358.5,20.75 358.5,9 358.75,8.75 CTRL2.MX1
PINC6
  Top 0.254: KP_4.MX1 37.25,47 37,47.25 37,49.75 37.25,50 37.25,65.75 KP_7.MX1 37.25,66 37,66.25 37,68.75 37.25,69 37.25,84.75 KP_SLASH.MX1 | _1.C6 194.75,4.5 194.25,4.5 191.75,2 44,2 37.5,8.5 KP_DEL.MX1 37.25,8.75 37,9 37,11.75 37.25,12 37.25,27.75 KP_1.MX1
  Bottom 0.254: KP_1.MX1 37.25,28 37.25,29.75 37,30 37,46.5 37.25,46.75 KP_4.MX1
PINC7  (via drill 0.38)
  Top 0.254: v176.75,16 186,16 197.25,4.75 _1.C7 | v127.25,17.75 91.5,17.75 76.25,33 29,33 18,22 18,18.75 18.25,18.5 ENTER2.MX1
  Bottom 0.254: KP_DASH.MX1 18.25,84.75 18,84.5 18,58.5 18.25,58.25 18.25,56.5 EQUAL2.MX1 18.25,56.25 18.25,21.5 18,21.25 18,18.75 18.25,18.5 ENTER2.MX1 | v176.75,16 144.5,16 142.75,17.75 v127.25,17.75
PIND0
  Top 0.254: _1.D0 184.75,4.75 184.25,4.75 170.5,18.5 169,18.5 168,19.5 168,20.5 175.25,27.75 C.MX1 | D.MX1 165.75,47 165.75,51.25 180.25,65.75 R.MX1
  Bottom 0.254: 4.MX1 170.75,84.75 170.75,82.5 180,73.25 180,66.25 180.25,66 R.MX1 | C.MX1 175.25,27.75 174,27.75 169.75,23.5 167,23.5 165,25.5 165,46 165.75,46.75 D.MX1
PIND1  (via drill 0.38)
  Top 0.254: v173,18.5 186.75,4.75 187.25,4.75 _1.D1 | S.MX1 147,47 148,47 161,60 161,65.75 E.MX1
  Bottom 0.254: v173,18.5 167,18.5 157.75,27.75 156.5,27.75 X.MX1 156.25,28 156.25,29.75 155.5,30.5 155.5,38.25 147,46.75 S.MX1 | 3.MX1 151.75,84.75 151.75,82.5 160.75,73.5 160.75,66.25 161,66 E.MX1
PIND2
  Top 0.254: 156.75,8.5 144.75,8.5 ALT.MX1 | 156.75,8.5 161,8.5 166.25,3.25 187.75,3.25 189,4.5 189.75,4.5 _1.D2 | 156.75,8.5 137.5,27.75 Z.MX1
  Bottom 0.254: 129,47 128,47 A.MX1 129,47 | 129,47 142,60 142,65.75 W.MX1 142,66 141.75,66.25 141.75,73.5 132.75,82.5 132.75,84.75 2.MX1 | 129,47 129,43.25 137,35.25 137,28.25 137.25,28 Z.MX1
PIND3  (via drill 0.38)
  Top 0.254: v183.25,13.75 192.25,4.75 _1.D3
  Bottom 0.254: 121.25,65.75 118.25,65.75 115.75,68.25 115.75,82.75 113.75,84.75 1.MX1 | 121.25,65.75 123,65.75 Q.MX1 | v183.25,13.75 141.75,13.75 141.5,14 127,14 126.25,13.25 | 126.25,13.25 121.75,8.75 120.75,8.75 WIN.MX1 | 121.25,65.75 121.25,47 126.25,42 126.25,13.25
PIND4  (via drill 0.38)
  Top 0.254: v188,17.25 197.25,17.25 _1.D4 | CAPSLOCK.MX1 101.75,46.75 101.75,39.75 106,35.5 106,28.25 106.25,28 SHIFT.MX1
  Bottom 0.254: CAPSLOCK.MX1 101.5,47 101.25,47.25 101.25,54.5 99.5,56.25 99.5,65.75 TAB.MX1 99.25,66 99,66.25 99,73.25 94.75,77.5 94.75,84.75 ESC.MX1 | v188,17.25 180.25,9.5 148.5,9.5 143.5,4.5 106.5,4.5 | 106.5,4.5 101,4.5 97,8.5 CTRL.MX1 | 106.5,4.5 106.5,27.75 SHIFT.MX1
PIND5
  Top 0.254: NUMLOCK.MX1 75.25,84.75 75.25,66 KP_9.MX1 75.25,65.75 75.25,47 KP_6.MX1 | KP_3.MX1 75.25,27.75 75.25,24.5 65.5,14.75 65.5,9 65.75,8.75 KP_0.MX1
  Bottom 0.254: KP_3.MX1 75.25,28 75.25,46.75 KP_6.MX1 | _1.D5 197.5,7 199,5.5 199,2.5 197.5,1 73.5,1 66,8.5 KP_0.MX1
PIND7
  Top 0.254: KP_5.MX1 56.25,47 56,47.25 56,49.75 56.25,50 56.25,65.75 KP_8.MX1 56.25,66 56,66.25 56,68.75 56.25,69 56.25,84.75 KP_ASTERISK.MX1
  Bottom 0.254: _1.D7 194.75,19.75 194.25,19.75 183.25,8.75 148.5,8.75 143.5,3.75 80.5,3.75 56.5,27.75 KP_2.MX1 56.25,28 56,28.25 56,30.5 56.25,30.75 56.25,46.75 KP_5.MX1
PINE6  (via drill 0.38)
  Top 0.254: v260,2 v197.25,2
  Bottom 0.254: 319.5,47 318.5,47 QUOTE.MX1 319.5,47 | 319.5,47 331,58.5 331,64.25 332.25,65.5 | 332.25,65.5 332.5,65.75 RBRACKET.MX1 332.25,65.5 | 332.25,65.5 332.25,73.5 323.25,82.5 323.25,84.75 EQUAL.MX1 | v197.25,2 169.75,2 168,3.75 168,5.75 169.25,7 179.5,7 _1.E6 | v260,2 328.5,2 334.75,8.25 | 334.75,8.25 335,8.5 MENU.MX1 334.75,8.25 | 319.5,47 319.5,40.5 334.75,25.25 334.75,8.25
PINF0  (via drill 0.38)
  Top 0.254: v191.75,23.5 176.25,23.5 172.75,20 172.25,20 _1.F0 | WIN2.MX1 311,8.75 311,25.75 309,27.75 SLASH.MX1
  Bottom 0.254: DASH.MX1 304.25,84.75 304.25,82.5 313.25,73.5 313.25,66.25 LBRACKET.MX1 313.5,65.75 313.5,60 299.25,45.75 | 298.25,23.5 304.5,23.5 308.75,27.75 SLASH.MX1 | 298.25,23.5 v191.75,23.5 | 299.25,45.75 299.25,31.75 298.25,30.75 298.25,23.5 | 299.25,45.75 299.25,46.75 SEMICOLON.MX1 299.25,45.75
PINF1  (via drill 0.38)
  Top 0.254: PERIOD.MX1 287,25 287,11 287.25,10.75 287.25,8.75 ALT2.MX1 | v192.75,42.5 276,42.5 280.25,46.75 L.MX1
  Bottom 0.254: v192.75,42.5 174.75,24.5 174.75,20 _1.F1 | 281.5,47 294.5,60 294.5,65.75 P.MX1 294.5,66 294.25,66.25 294.25,73.25 285.25,82.25 285.25,84.75 0.MX1 | 281.5,47 280.5,47 L.MX1 281.5,47 | 281.5,47 288.75,39.75 288.75,30.5 289.75,29.5 289.75,28 PERIOD.MX1
PINF2
  Bottom 0.254: 261.75,46.25 261.25,46.75 K.MX1 261.75,46.25 | 261.75,46.25 270.5,37.5 270.5,28 COMMA.MX1 | 261.75,46.25 275.5,60 275.5,65.75 O.MX1 275.5,66 275.25,66.25 275.25,73.25 266,82.5 266,84.75 9.MX1
PINF3
  Bottom 0.254: 242.75,46.25 242.25,46.75 J.MX1 242.75,46.25 | 242.75,46.25 250.75,38.25 250.75,30.5 251.5,29.75 251.5,28 M.MX1 | 242.75,46.25 256.25,59.75 256.25,65.75 I.MX1 256.25,66 256,66.25 256,73.5 247,82.5 247,84.75 8.MX1
PINF4  (via drill 0.38)
  Top 0.254: v202.5,45 208.25,45 209.75,46.5 222.75,46.5 223,46.75 H.MX1
  Bottom 0.254: v202.5,45 200,42.5 194,42.5 177.25,25.75 177.25,20 _1.F4 | 223.75,46.25 223.25,46.75 H.MX1 223.75,46.25 | 223.75,46.25 231.5,38.5 231.5,30.75 232.5,29.75 232.5,28 N.MX1 | 223.75,46.25 237.25,59.75 237.25,65.75 U.MX1 237.25,66 237,66.25 237,73.5 228,82.5 228,84.75 7.MX1
PINF6
  Top 0.254: SPACE.MX1 215.75,8.75 215.75,25.75 213.75,27.75 B.MX1
  Bottom 0.254: _1.F6 182.25,23.25 188,29 188,31.5 190.5,34 192.75,34 203.75,45 | 203.75,45 204,45.25 204,45.75 | 204,45.75 204,46.75 G.MX1 204,45.75 | 204,45.75 218.25,60 218.25,65.75 Y.MX1 218,66.25 218,73.5 209,82.5 209,84.75 6.MX1 | 203.75,45 212.5,36.25 212.5,30.5 213.5,29.5 213.5,28 B.MX1
PINF7
  Top 0.254: V.MX1 194.5,28 194.5,29.5 193.5,30.5 193.5,37.25 185.25,45.5 185.25,46.75 F.MX1
  Bottom 0.254: _1.F7 185,20 185.5,20 193.25,27.75 194.5,27.75 V.MX1 | F.MX1 185.25,47 186.25,47 199.25,60 199.25,65.75 T.MX1 199.25,66 199,66.25 199,73.25 190,82.25 190,84.75 5.MX1